# EAGLE schematic Teensy_board (EAGLE 7.1.0)
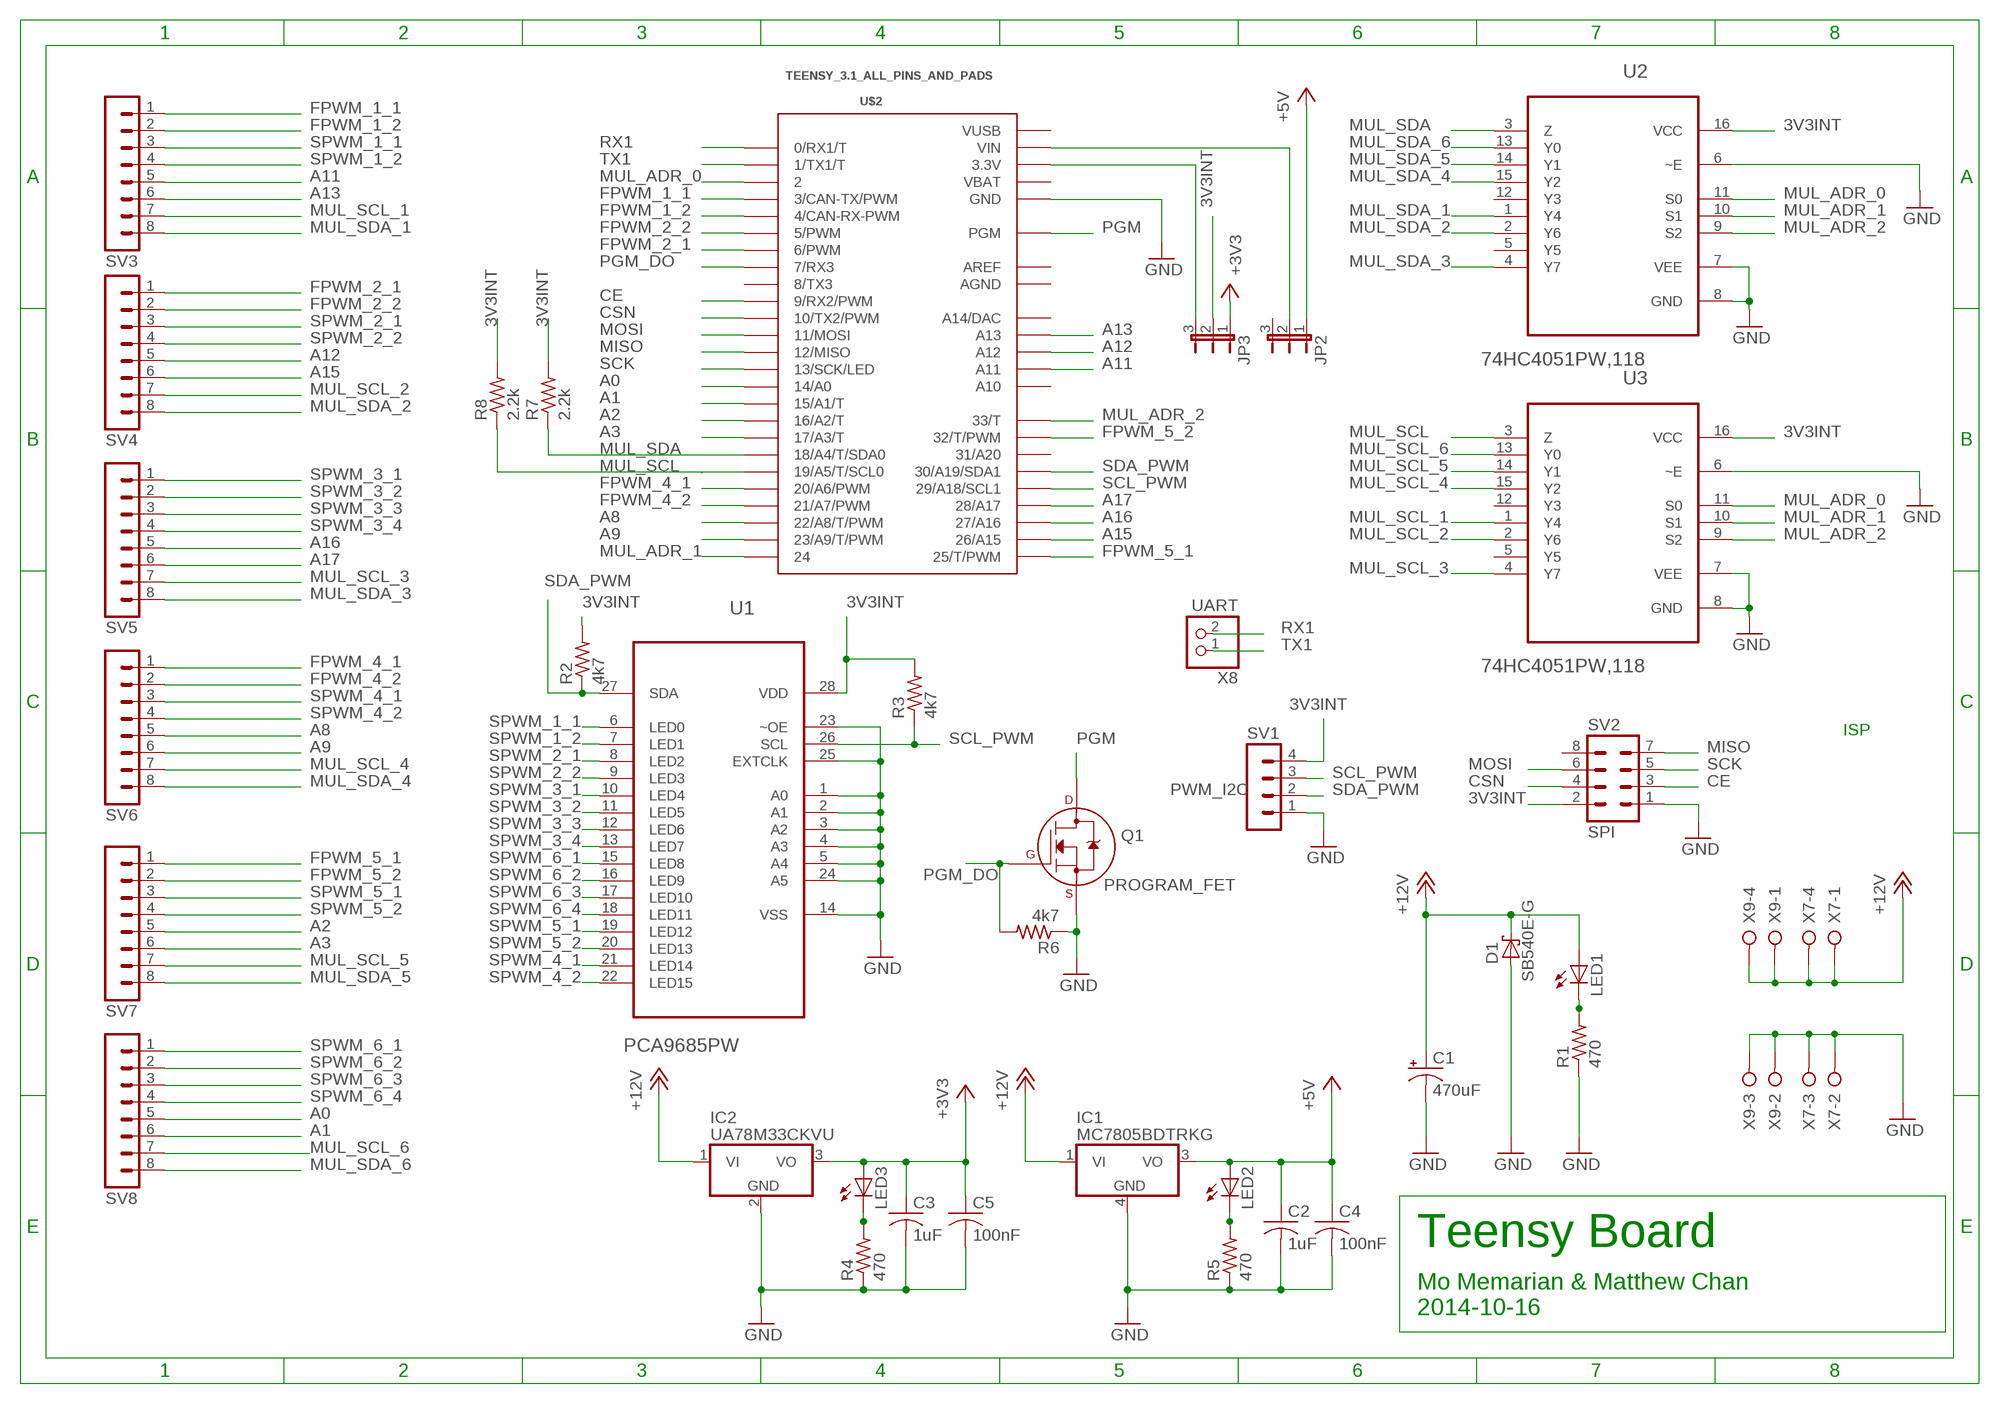
[diagram p0: schematic, sheet 1]

## Parts
C1  470uF  CPOL-USE5-10.5  [E5-10,5]
C2  1uF  C-USC0603  [C0603]
C3  1uF  C-USC0603  [C0603]
C4  100nF  C-USC0603  [C0603]
C5  100nF  C-USC0603  [C0603]
D1  SB540E-G  [DO201T15]
IC1  MC7805BDTRKG  [DPACK_3]
IC2  UA78M33CKVU  [DPACK]
JP2  JP2E  [JP2]
JP3  JP2E  [JP2]
LED1  LEDSML1206  [SML1206]
LED2  LEDSML1206  [SML1206]
LED3  LEDSML1206  [SML1206]
Q1  PROGRAM_FET  2N7002_SOT23  [SOT-23]
R1  470  R-US_R0603  [R0603]
R2  4k7  R-US_R0603  [R0603]
R3  4k7  R-US_R0603  [R0603]
R4  470  R-US_R0603  [R0603]
R5  470  R-US_R0603  [R0603]
R6  4k7  R-US_R0603  [R0603]
R7  2.2k  R-US_R0603  [R0603]
R8  2.2k  R-US_R0603  [R0603]
SV1  PWM_I2C  MA04-1  [MA04-1]
SV2  SPI  MA04-2  [MA04-2]
SV3  MA08-1  [MA08-1]
SV4  MA08-1  [MA08-1]
SV5  MA08-1  [MA08-1]
SV6  MA08-1  [MA08-1]
SV7  MA08-1  [MA08-1]
SV8  MA08-1  [MA08-1]
U1  PCA9685PW  [SOP65P640X110-28N]
U2  74HC4051PW,118  [SOP65P640X110-16N]
U3  74HC4051PW,118  [SOP65P640X110-16N]
U$2  TEENSY_3.1_ALL_PINS_AND_PADS  [TEENSY_3.1_ALLPINS]
X7  W237-04P  [W237-4P]
X8  UART  PINHD-1X2  [1X02]
X9  W237-04P  [W237-4P]

## Nets
3V3INT: JP3.2 R2.2 R3.2 R7.2 R8.2 SV1.4 SV2.2 U1.28(VDD) U2.16(VCC) U3.16(VCC)
+3V3: C3.1 C5.1 IC2.3(VO) JP3.1 LED3.A
+5V: C2.1 C4.1 IC1.3(VO) JP2.1 LED2.A
+12V: C1.+ D1.C IC1.1(VI) IC2.1(VI) LED1.A X7.1 X7.4 X9.1 X9.4
A0: SV8.5 U$2.14/A0
A1: SV8.6 U$2.15/A1(15/A1/T)
A2: SV7.5 U$2.16/A2(16/A2/T)
A3: SV7.6 U$2.17/A3(17/A3/T)
A8: SV6.5 U$2.22/A8(22/A8/T/PWM)
A9: SV6.6 U$2.23/A9(23/A9/T/PWM)
A11: SV3.5 U$2.A11
A12: SV4.5 U$2.A12
A13: SV3.6 U$2.A13
A15: SV4.6 U$2.26(26/A15)
A16: SV5.5 U$2.27(27/A16)
A17: SV5.6 U$2.28(28/A17)
CE: SV2.3 U$2.9(9/RX2/PWM)
CSN: SV2.4 U$2.10(10/TX2/PWM)
FPWM_1_1: SV3.1 U$2.3(3/CAN-TX/PWM)
FPWM_1_2: SV3.2 U$2.4(4/CAN-RX-PWM)
FPWM_2_1: SV4.1 U$2.6(6/PWM)
FPWM_2_2: SV4.2 U$2.5(5/PWM)
FPWM_4_1: SV6.1 U$2.20/A6(20/A6/PWM)
FPWM_4_2: SV6.2 U$2.21/A7(21/A7/PWM)
FPWM_5_1: SV7.1 U$2.25(25/T/PWM)
FPWM_5_2: SV7.2 U$2.32(32/T/PWM)
GND: C1.- C2.2 C3.2 C4.2 C5.2 D1.A IC1.4(GND) IC2.2(GND) Q1.2(S) R1.1 R4.1 R5.1 R6.1 SV1.1 SV2.1 U1.1(A0) U1.2(A1) U1.3(A2) U1.4(A3) U1.5(A4) U1.14(VSS) U1.23(~OE) U1.24(A5) U1.25(EXTCLK) U2.6(~E) U2.7(VEE) U2.8(GND) U3.6(~E) U3.7(VEE) U3.8(GND) U$2.GND U$2.GND1(GND) U$2.GND2(GND) X7.2 X7.3 X9.2 X9.3
MISO: SV2.7 U$2.12(12/MISO)
MOSI: SV2.6 U$2.11(11/MOSI)
MUL_ADR_0: U2.11(S0) U3.11(S0) U$2.2
MUL_ADR_1: U2.10(S1) U3.10(S1) U$2.24
MUL_ADR_2: U2.9(S2) U3.9(S2) U$2.33(33/T)
MUL_SCL: R8.1 U3.3(Z) U$2.19/A5(19/A5/T/SCL0)
MUL_SCL_1: SV3.7 U3.1(Y4)
MUL_SCL_2: SV4.7 U3.2(Y6)
MUL_SCL_3: SV5.7 U3.4(Y7)
MUL_SCL_4: SV6.7 U3.15(Y2)
MUL_SCL_5: SV7.7 U3.14(Y1)
MUL_SCL_6: SV8.7 U3.13(Y0)
MUL_SDA: R7.1 U2.3(Z) U$2.18/A4(18/A4/T/SDA0)
MUL_SDA_1: SV3.8 U2.1(Y4)
MUL_SDA_2: SV4.8 U2.2(Y6)
MUL_SDA_3: SV5.8 U2.4(Y7)
MUL_SDA_4: SV6.8 U2.15(Y2)
MUL_SDA_5: SV7.8 U2.14(Y1)
MUL_SDA_6: SV8.8 U2.13(Y0)
N$10: LED1.C R1.2
N$18: LED3.C R4.2
N$19: LED2.C R5.2
PGM: Q1.3(D) U$2.PGM
PGM_DO: Q1.1(G) R6.2 U$2.7(7/RX3)
RX1: U$2.0(0/RX1/T) X8.2
SCK: SV2.5 U$2.13(13/SCK/LED)
SCL_PWM: R3.1 SV1.3 U1.26(SCL) U$2.29(29/A18/SCL1)
SDA_PWM: R2.1 SV1.2 U1.27(SDA) U$2.30(30/A19/SDA1)
SPWM_1_1: SV3.3 U1.6(LED0)
SPWM_1_2: SV3.4 U1.7(LED1)
SPWM_2_1: SV4.3 U1.8(LED2)
SPWM_2_2: SV4.4 U1.9(LED3)
SPWM_3_1: SV5.1 U1.10(LED4)
SPWM_3_2: SV5.2 U1.11(LED5)
SPWM_3_3: SV5.3 U1.12(LED6)
SPWM_3_4: SV5.4 U1.13(LED7)
SPWM_4_1: SV6.3 U1.21(LED14)
SPWM_4_2: SV6.4 U1.22(LED15)
SPWM_5_1: SV7.3 U1.19(LED12)
SPWM_5_2: SV7.4 U1.20(LED13)
SPWM_6_1: SV8.1 U1.15(LED8)
SPWM_6_2: SV8.2 U1.16(LED9)
SPWM_6_3: SV8.3 U1.17(LED10)
SPWM_6_4: SV8.4 U1.18(LED11)
TEENSY_3V3: JP3.3 U$2.3.3V U$2.3.3V1(3.3V) U$2.3.3V2(3.3V)
TEENSY_VIN: JP2.2 U$2.VIN
TX1: U$2.1(1/TX1/T) X8.1
Unconnected: JP2.3 SV2.8 U2.5(Y5) U2.12(Y3) U3.5(Y5) U3.12(Y3) U$2.8(8/TX3) U$2.31(31/A20) U$2.A10 U$2.A14(A14/DAC)

## Notes on the sheet
- ISP
- Teensy Board
- Mo Memarian & Matthew Chan
  2014-10-16

## Power pins joined to a net without a drawn wire
AGND: U$2.AGND
AREF: U$2.AREF
VBAT: U$2.VBAT
VUSB: U$2.VUSB

## Library data of the parts
C1 = rcl:CPOL-US: POLARIZED CAPACITOR, American symbol
C2-C5 = rcl:C-US: CAPACITOR, American symbol
D1 = CBLA_Test_bed_Library:SB540E-G: SCHOTTKY BARRIER RECTIFIER 3.0 AMPERES 20, 30, 40 VOLT Source: MBRS340T3-D.pdf
IC1 = CBLA_Test_bed_Library:MC78: 1A Positive Voltage Regulators Source: Data sheet <http://www.onsemi.com/pub_link/Collateral/MC7800-D.PDF>
IC2 = CBLA_Test_bed_Library:UA78M: Linear Voltage Reg Datasheet <http://www.ti.com/lit/ds/symlink/ua78m05.pdf>
JP2 JP3 = jumper:JP2E: JUMPER
LED1-LED3 = led:LED: LED OSRAM: - CHIPLED LG R971, LG N971, LY N971, LG Q971, LY Q971, LO R971, LY R971 LH N974, LH R974 LS Q976, LO Q976, LY Q976 LO Q996 - Hyper CHIPLED LW Q18S LB Q993, LB Q99A, LB R99A - SideLED LS A670, LO A670, LY A670, LG A670, LP A670 LB A673, LV A673, LT A673, LW A673 LH A674 LY A675 LS A676, LA A676, LO A676, LY A676, LW A676 LS A679, LY A679, LG A679 - Hyper Micro SIDELED® LS Y876, LA Y876, LO Y876, LY Y876 LT Y87S - SmartLED LW L88C, LW L88S LB L89C, LB L89S, LG L890 LS L89K, LO L89K, LY L89K LS L896, LA L896, LO L896, LY L896 - TOPLED LS T670, LO T670, LY T670, LG T670, LP T670 LSG T670, LSP T670, LSY T670, LOP T670, LYG T670 LG T671, LOG T671, LSG T671 LB T673, LV T673, LT T673, LW T673 LH T674 LS T676, LA T676, LO T676, LY T676, LB T676, LH T676, LSB T676, LW T676 LB T67C, LV T67C, LT T67C, LS T67K, LO T67K, LY T67K, LW E67C LS E67B, LA E67B, LO E67B, LY E67B, LB E67C, LV E67C, LT E67C LW T67C LS T679, LY T679, LG T679 LS T770, LO T770, LY T770, LG T770, LP T770 LB T773, LV T773, LT T773, LW T773 LH T774 LS E675, LA E675, LY E675, LS T675 LS T776, LA T776, LO T776, LY T776, LB T776 LHGB T686 LT T68C, LB T68C - Hyper Mini TOPLED® LB M676 - Mini TOPLED Santana® LG M470 LS M47K, LO M47K, LY M47K Source: http://www.osram.convergy.de LUXEON: - LUMILED® LXK2-PW12-R00, LXK2-PW12-S00, LXK2-PW14-U00, LXK2-PW14-V00 LXK2-PM12-R00, LXK2-PM12-S00, LXK2-PM14-U00 LXK2-PE12-Q00, LXK2-PE12-R00, LXK2-PE12-S00, LXK2-PE14-T00, LXK2-PE14-U00 LXK2-PB12-K00, LXK2-PB12-L00, LXK2-PB12-M00, LXK2-PB14-N00, LXK2-PB14-P00, LXK2-PB14-Q00 LXK2-PR12-L00, LXK2-PR12-M00, LXK2-PR14-Q00, LXK2-PR14-R00 LXK2-PD12-Q00, LXK2-PD12-R00, LXK2-PD12-S00 LXK2-PH12-R00, LXK2-PH12-S00 LXK2-PL12-P00, LXK2-PL12-Q00, LXK2-PL12-R00 Source: www.luxeon.com KINGBRIGHT: KA-3528ASYC Source: www.kingbright.com
Q1 = transistors:2N700*: 2N7000, 2N7002, NDS7002A N-channel enhancement mode MOSFET
R1-R8 = CBLA_Test_bed_Library:R-US_: RESISTOR, American symbol
SV1 = con-lstb:MA04-1: PIN HEADER; OC_FARNELL: unknown; OC_NEWARK: unknown
SV2 = con-lstb:MA04-2: PIN HEADER; OC_FARNELL: unknown; OC_NEWARK: unknown
SV3-SV8 = con-lstb:MA08-1: PIN HEADER; OC_FARNELL: unknown; OC_NEWARK: unknown
U1 = NXP_By_element14_Batch_1:PCA9685PW: 16-channel, 12-bit PWM Fm+ I2C-bus LED controller; MPN: PCA9685PW; OC_FARNELL: 1854074; OC_NEWARK: 19T6398; PACKAGE: TSSOP-28; SUPPLIER: NXP
U2 U3 = NXP_By_element14_Batch_1:74HC4051PW,118: 8-channel analog multiplexer/demultiplexer; MPN: 74HC4051PW,118; OC_FARNELL: 1826843; OC_NEWARK: 78R6260; PACKAGE: TSSOP-16; SUPPLIER: NXP
U$2 = Teensy_3_Series_Board_v1.0:TEENSY_3.1_ALL_PINS_AND_PADS: Footprint for Teensy 3.1 board using all pads and all through-holes. Pads need a 2x7 0.1" SMD header.
X7 X9 = con-wago-508:W237-04P: WAGO SREW CLAMP; OC_FARNELL: unknown; OC_NEWARK: unknown
X8 = CBLA_Test_bed_Library:PINHD-1X2: PIN HEADER